# Altium schematic sheet UI.SchDoc
size A3
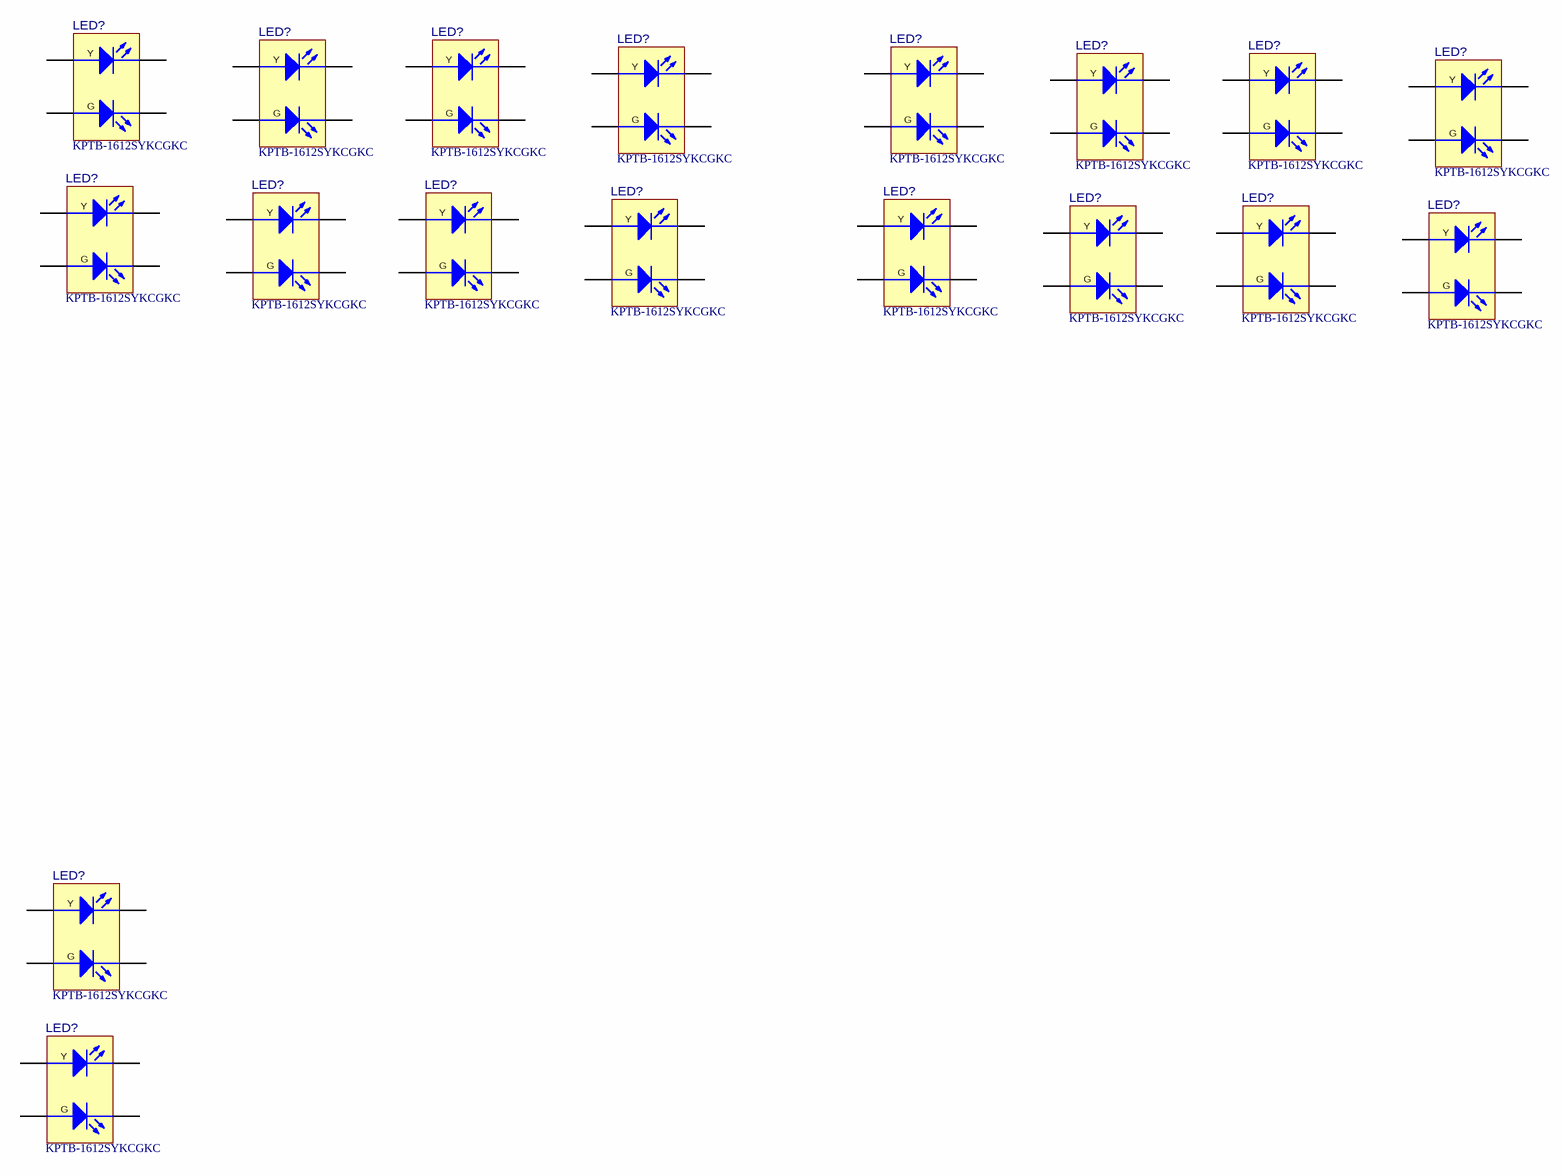
[diagram p0: UI.SchDoc]

## Parts
(Parts that share a designator on the sheet are numbered #1, #2 ... from top to bottom, then left to right.)
LED?#1  KPTB-1612SYKCGKC  [KING_SMD160X125]
LED?#2  KPTB-1612SYKCGKC  [KING_SMD160X125]
LED?#3  KPTB-1612SYKCGKC  [KING_SMD160X125]
LED?#4  KPTB-1612SYKCGKC  [KING_SMD160X125]
LED?#5  KPTB-1612SYKCGKC  [KING_SMD160X125]
LED?#6  KPTB-1612SYKCGKC  [KING_SMD160X125]
LED?#7  KPTB-1612SYKCGKC  [KING_SMD160X125]
LED?#8  KPTB-1612SYKCGKC  [KING_SMD160X125]
LED?#9  KPTB-1612SYKCGKC  [KING_SMD160X125]
LED?#10  KPTB-1612SYKCGKC  [KING_SMD160X125]
LED?#11  KPTB-1612SYKCGKC  [KING_SMD160X125]
LED?#12  KPTB-1612SYKCGKC  [KING_SMD160X125]
LED?#13  KPTB-1612SYKCGKC  [KING_SMD160X125]
LED?#14  KPTB-1612SYKCGKC  [KING_SMD160X125]
LED?#15  KPTB-1612SYKCGKC  [KING_SMD160X125]
LED?#16  KPTB-1612SYKCGKC  [KING_SMD160X125]
LED?#17  KPTB-1612SYKCGKC  [KING_SMD160X125]
LED?#18  KPTB-1612SYKCGKC  [KING_SMD160X125]

## Nets

Not connected (* = marked no-connect by the designer): LED?#1 1(AR) 2(CR) 3(AG) 4(CG); LED?#2 1(AR) 2(CR) 3(AG) 4(CG); LED?#3 1(AR) 2(CR) 3(AG) 4(CG); LED?#4 1(AR) 2(CR) 3(AG) 4(CG); LED?#5 1(AR) 2(CR) 3(AG) 4(CG); LED?#6 1(AR) 2(CR) 3(AG) 4(CG); LED?#7 1(AR) 2(CR) 3(AG) 4(CG); LED?#8 1(AR) 2(CR) 3(AG) 4(CG); LED?#9 1(AR) 2(CR) 3(AG) 4(CG); LED?#10 1(AR) 2(CR) 3(AG) 4(CG); LED?#11 1(AR) 2(CR) 3(AG) 4(CG); LED?#12 1(AR) 2(CR) 3(AG) 4(CG); LED?#13 1(AR) 2(CR) 3(AG) 4(CG); LED?#14 1(AR) 2(CR) 3(AG) 4(CG); LED?#15 1(AR) 2(CR) 3(AG) 4(CG); LED?#16 1(AR) 2(CR) 3(AG) 4(CG); LED?#17 1(AR) 2(CR) 3(AG) 4(CG); LED?#18 1(AR) 2(CR) 3(AG) 4(CG)

## Notes on the sheet
- CONFIDENTIAL
- Copyright (C) 2018 Deciduous Development AB
- Title
- Drawn By
- Date
- Time
- Checked By
- Revision
- Document Number
- Page
- of
- All rights reserved. No part of this documentation may be reproduced without the written permission of Deciduous Development AB.
- (in symbol KPTB-1612SYKCGKC) Y; G

## Library data of the parts
LED?#1-LED?#18 = KPTB-1612SYKCGKC: 1.6X1.25mm BI-Color SMD Chip LED Lamp (Yellow/Green)